# EAGLE board Schematic_tema_tsc (EAGLE 9.7.0)
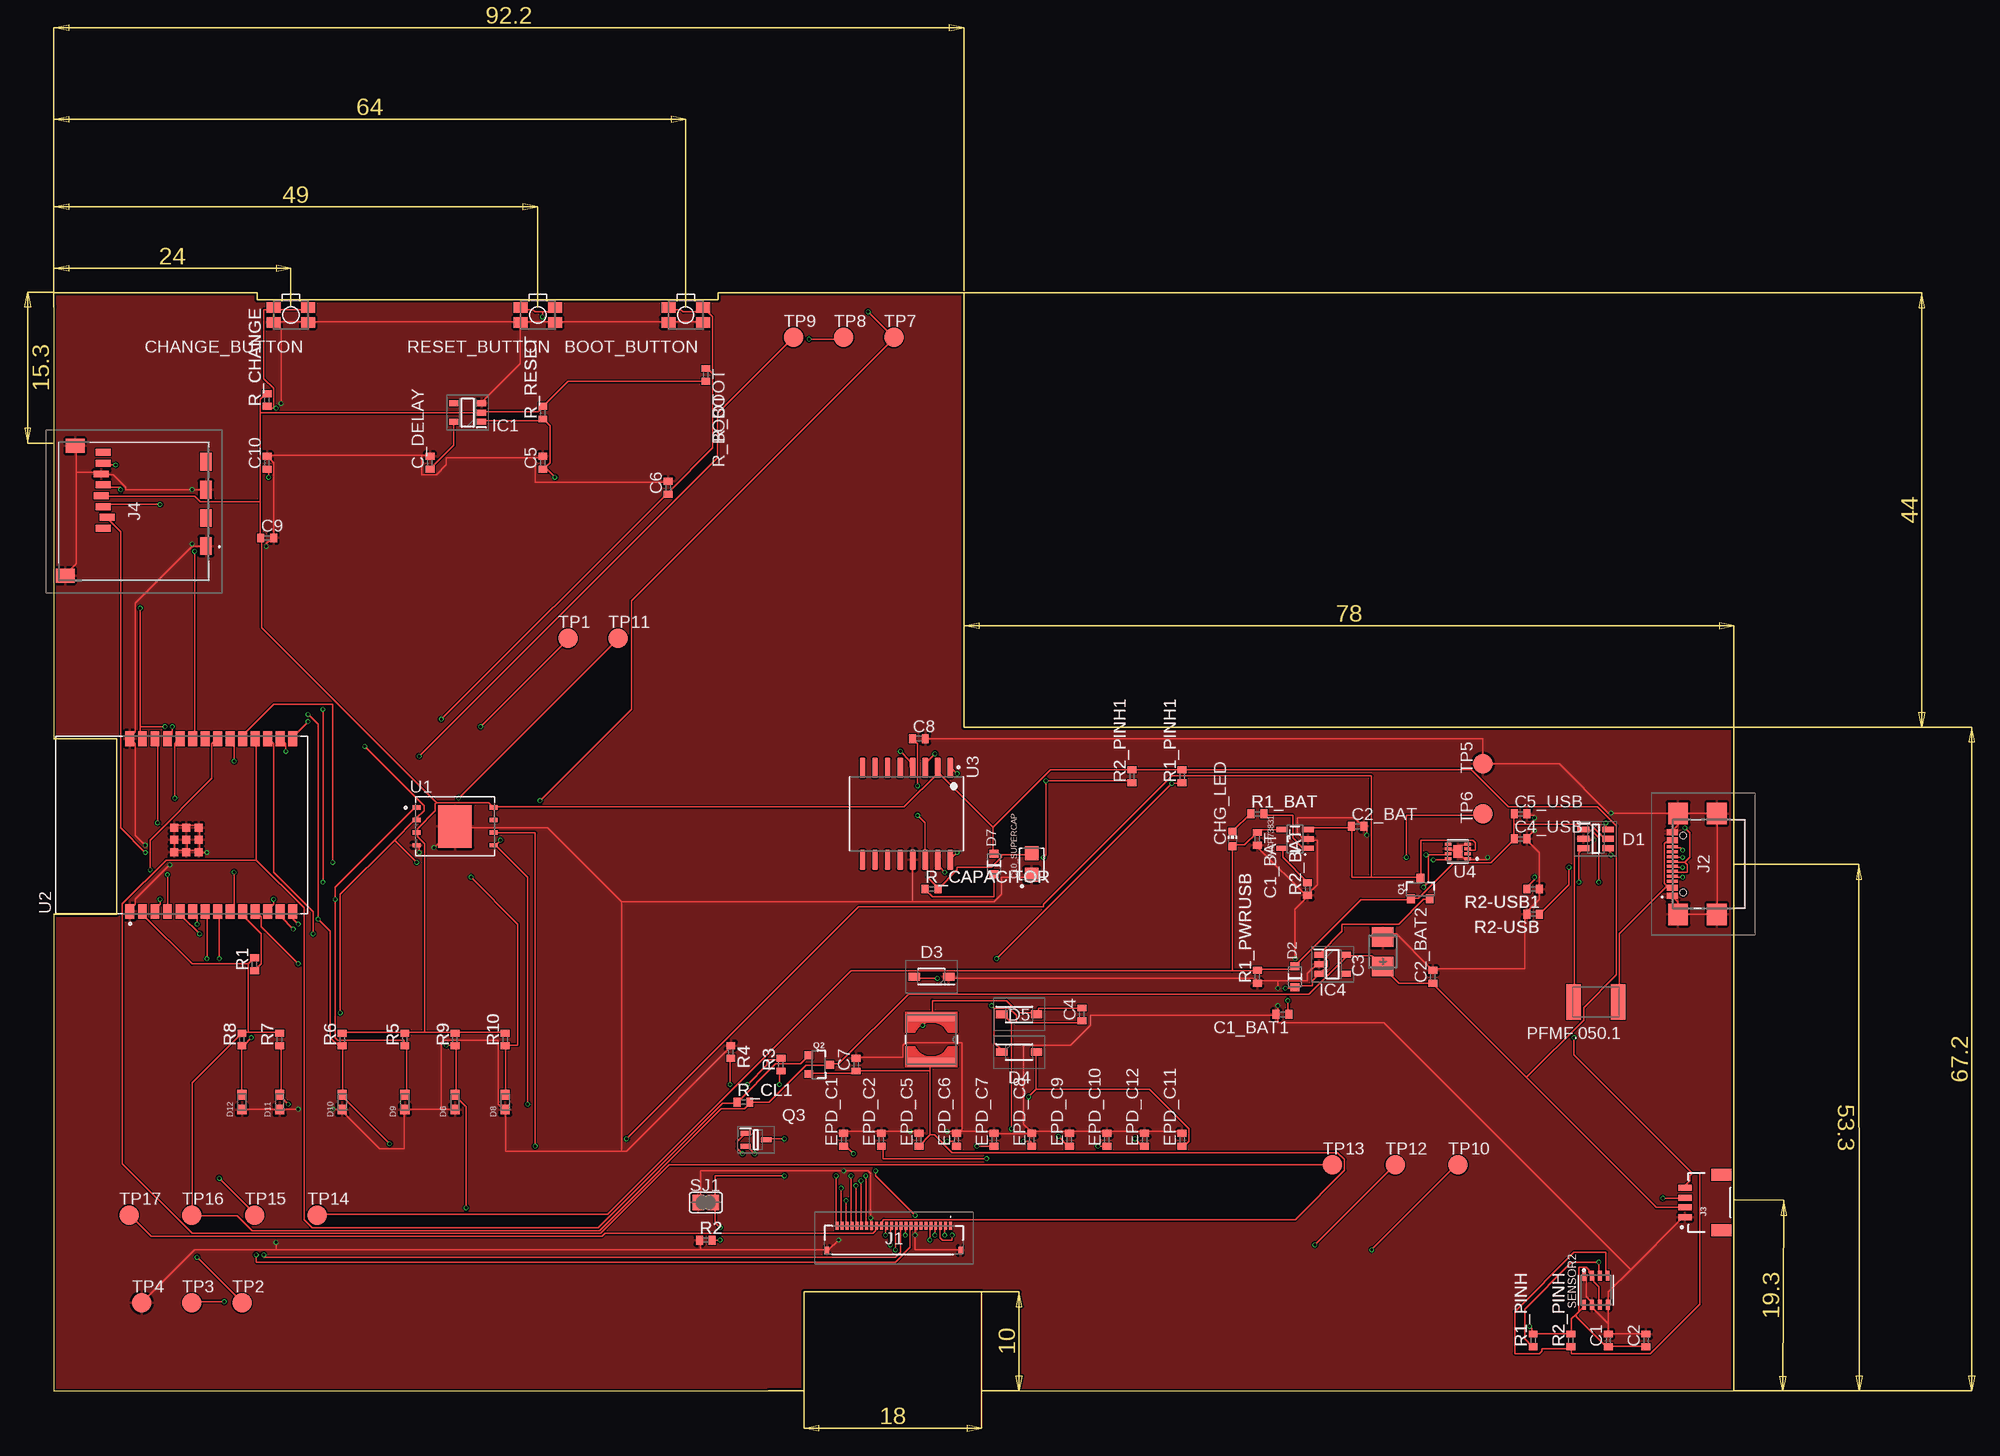
[diagram p1: board, top side]
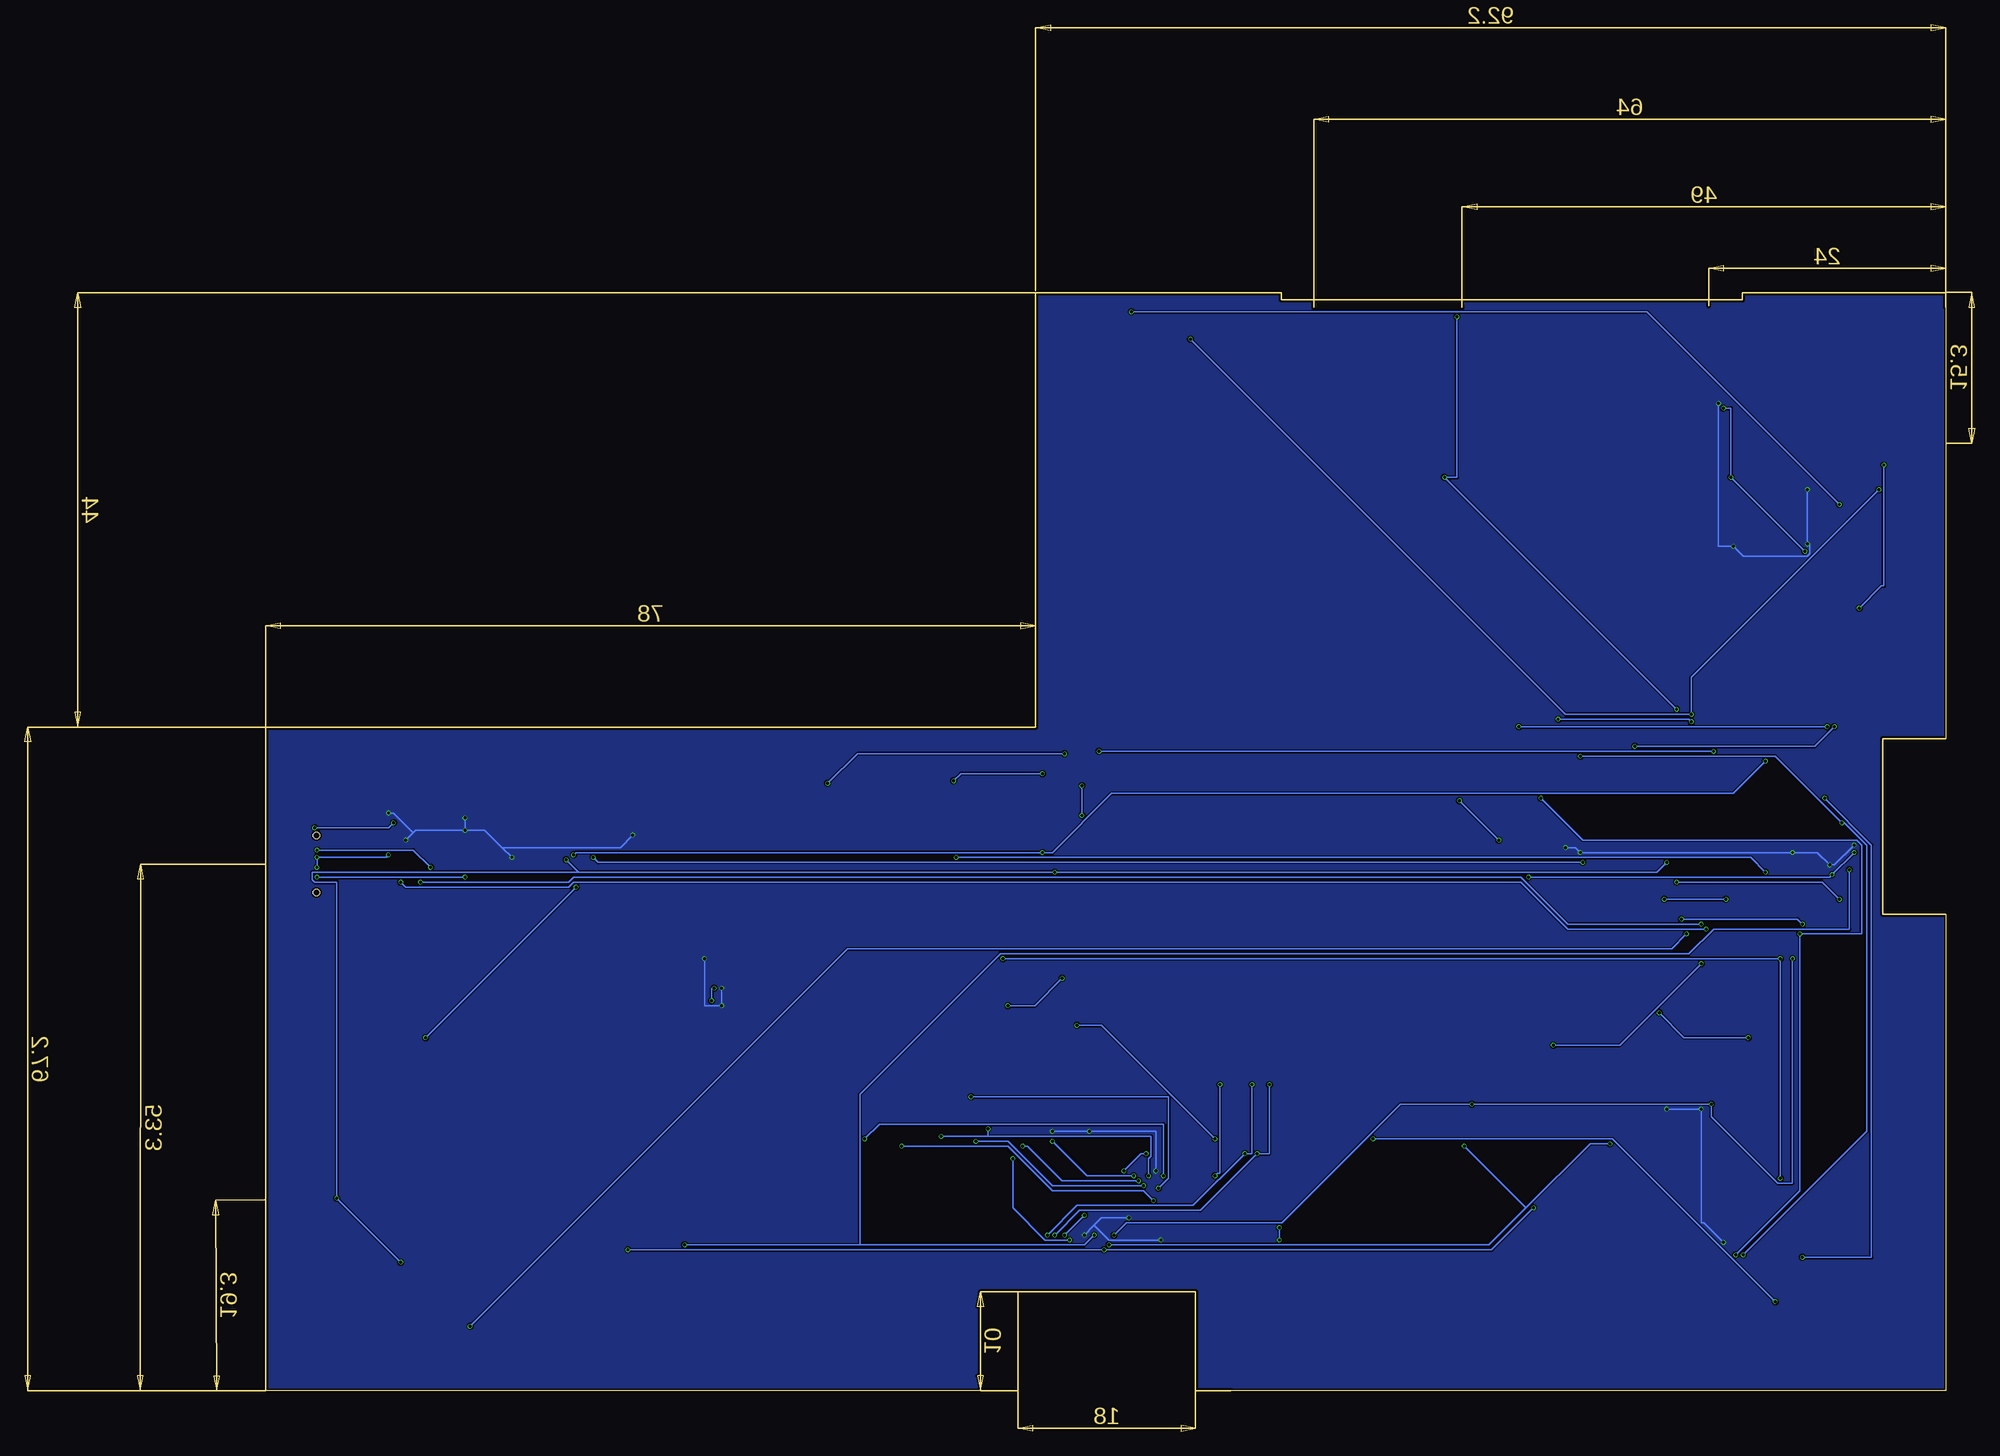
[diagram p2: board, bottom side, seen from below]

Size 170.2 x 111.2 mm. Coordinates in mm from the lower left corner, seen from the top.
Outline: 0,0 72.39,0 75.98,0 75.98,10 93.98,10 93.98,0 170.2,0 170.2,67.2 92.2,67.2 92.2,111.2 67.28,111.2 67.28,110.49 20.61,110.49 20.61,111.2 0,111.2 0,66.04 6.35,66.04 6.35,48.26 0,48.26 0,0
Copper layers (1*16): Top 0.035mm / dielectric 1.6mm / Bottom 0.035mm
Design rules "jlcpcb-2layers.dru": minimum track width 0.15mm, minimum drill 0.3mm, track to track 5mil, track to pad 5mil, pad to pad 5mil, via to via 5mil, smd to smd 5mil, copper to edge 0.2mm, drill to drill 6mil, minimum pad ring 10mil, minimum via ring 3mil, stop-mask expansion 4mil, vias tented up to drill 0mil, thermal gap 10mil

## Footprints (pad centres in the part's own frame; a part is rotated, then mirrored left to right if it is on the bottom)
MYBUTTON = smd 1.4 x 1.05: 1 1.75,0.75; 2 -1.75,0.75; 3 -1.75,-0.75; 4 1.75,-0.75
EAGLE-LTSPICE_C0402 = smd 0.7 x 0.9: 1 -0.65,0; 2 0.65,0
RCL_CT3528 = smd 2 x 2.2: + -1.5,0; - 1.5,0
CAPCP3225X100N = smd 1.4 x 1.4: 1 -1.1,0; 2 1.1,0
ADAFRUIT_CHIP-LED0603 = smd 0.8 x 0.8: A 0,-0.75; C 0,0.75
SOT95P280X145-6N = smd 1.2 x 0.6: 1 -1.25,0.95; 2 -1.25,0; 3 -1.25,-0.95; 4 1.25,-0.95; 5 1.25,0; 6 1.25,0.95
ESP32_WROVER_AVX---SD0805S020S1R0_AVX_SD0805S020S1R0_0 = smd 0.8 x 0.9: 1 -1.05,0; 2 1.05,0
SOD3716X135N = smd 1.15 x 0.8: 1 -1.75,0; 2 1.75,0
DIOC1608X36N = smd 0.97 x 0.94: 1 -0.75,0; 2 0.75,0
SOT95P280X125-5N = smd 0.9 x 0.6: 1 -1.4,0.95; 2 -1.4,0; 3 -1.4,-0.95; 4 1.4,-0.95; 5 1.4,0.95
SOT95P280X120-5N = smd 0.9 x 0.6: 1 -1.4,0.95; 2 -1.4,0; 3 -1.4,-0.95; 4 1.4,-0.95; 5 1.4,0.95
FH34SRJ24S05SH99 = smd 0.3 x 0.8: 1 5.75,1.45; 2 5.25,1.45; 3 4.75,1.45; 4 4.25,1.45; 5 3.75,1.45; 6 3.25,1.45; 7 2.75,1.45; 8 2.25,1.45; 9 1.75,1.45; 10 1.25,1.45; 11 0.75,1.45; 12 0.25,1.45; 13 -0.25,1.45; 14 -0.75,1.45; 15 -1.25,1.45; 16 -1.75,1.45; 17 -2.25,1.45; 18 -2.75,1.45; 19 -3.25,1.45; 20 -3.75,1.45; 21 -4.25,1.45; 22 -4.75,1.45; 23 -5.25,1.45; 24 -5.75,1.45 | smd 0.4 x 0.8: MP1 6.75,-1.05; MP2 -6.75,-1.05
SAMACSYS_PARTS_USB4110GFA = smd 0.3 x 1.15: A1 -3.35,3.678; A4 -2.55,3.678; A5 -1.25,3.678; A6 -0.25,3.678; A7 0.25,3.678; A8 1.25,3.678; A9 2.55,3.678; A12 3.35,3.678; B1 3.05,3.678; B4 2.25,3.678; B5 1.75,3.678; B6 0.75,3.678; B7 -0.75,3.678; B8 -1.75,3.678; B9 -2.25,3.678; B12 -3.05,3.678 | smd 2.18 x 2: MP1 -5.11,-0.827; MP2 5.11,-0.827; MP3 -5.11,3.103; MP4 5.11,3.103 | hole 0.65: -2.89,2.603; 2.89,2.603
JST04_1MM_RA = smd 0.6 x 1.35: 1 -1.5,0; 2 -0.5,0; 3 0.5,0; 4 1.5,0 | smd 1.2 x 2: NC1 2.8,-3.675; NC2 -2.8,-3.675
112ATAARR03ATTEND = smd 1.8 x 1.2: G1 10.6,10.4; G2 4.9,10.4; S1 7.75,10.4; S2 2.05,10.4 | smd 1.4 x 1.9: G3 13.6,-3.85; G4 0.45,-2.85 | smd 0.7 x 1.5: P1 8.8,0; P2 7.7,0.4; P3 6.6,0; P4 5.5,-0.2; P5 4.4,0; P6 3.3,-0.2; P7 2.2,0; P8 1.1,0
IND_4828-WE-TPC_WRE = smd 0.889 x 4.826: 1 -2.286,0; 2 2.286,0
ESP32_WROVER_SPARKFUN-IC-POWER_SOT23-5 = smd 0.55 x 1.2: 1 -0.95,-1.3; 2 0,-1.3; 3 0.95,-1.3; 4 0.95,1.3; 5 -0.95,1.3
ESP32C6_VARISTOR_CT/CN1812 = smd 1.5 x 3.6: 1 -2.25,0; 2 2.25,0
ESP32_WROVER_SPARKFUN-DISCRETESEMI_SOT23-3 = smd 0.8 x 0.9: 1 -0.95,-1; 2 0.95,-1; 3 0,1.1
SOT65P210X110-3N = smd 1.05 x 0.5: 1 -1.05,0.65; 2 -1.05,-0.65; 3 1.05,0
ESP32_WROVER_EAGLE-LTSPICE_R0402 = smd 0.7 x 0.9: 1 -0.65,0; 2 0.65,0
ESP32_WROVER_BME680_PSON80P300X300X100-8N = smd 1.016 x 0.5: 1 1.458,1.2; 2 1.458,0.4; 3 1.458,-0.4; 4 1.458,-1.2; 5 -1.458,-1.22; 6 -1.458,-0.4; 7 -1.458,0.4; 8 -1.458,1.2
SJ = smd 1.168 x 1.6: 1 -0.762,0; 2 0.762,0
TP20R = smd 2 x 2: TP 0,0
SON127P600X800X80-9N = smd 0.94 x 0.44: 1 -3.895,1.905; 2 -3.895,0.635; 3 -3.895,-0.635; 4 -3.895,-1.905; 5 3.895,-1.905; 6 3.895,-0.635; 7 3.895,0.635; 8 3.895,1.905 | smd 3.4 x 4.3: 9 0,0
XCVR_ESP32-C6-WROOM-1-N8 = smd 1.5 x 0.9: 1 -8.75,5.26; 2 -8.75,3.99; 3 -8.75,2.72; 4 -8.75,1.45; 5 -8.75,0.18; 6 -8.75,-1.09; 7 -8.75,-2.36; 8 -8.75,-3.63; 9 -8.75,-4.9; 10 -8.75,-6.17; 11 -8.75,-7.44; 12 -8.75,-8.71; 13 -8.75,-9.98; 14 -8.75,-11.25; 15 8.75,-11.25; 16 8.75,-9.98; 17 8.75,-8.71; 18 8.75,-7.44; 19 8.75,-6.17; 20 8.75,-4.9; 21 8.75,-3.63; 22 8.75,-2.36; 23 8.75,-1.09; 24 8.75,0.18; 25 8.75,1.45; 26 8.75,2.72; 27 8.75,3.99; 28 8.75,5.26 | smd 0.8 x 0.8: 29_1 -2.755,0.79; 29_2 -1.505,0.79; 29_3 -0.255,0.79; 29_4 -2.755,-0.46; 29_5 -1.505,-0.46; 29_6 -0.255,-0.46; 29_7 -2.755,-1.71; 29_8 -1.505,-1.71; 29_9 -0.255,-1.71
SOIC127P1032X265-16N = smd 2.05 x 0.59: 1 -4.655,4.445; 2 -4.655,3.175; 3 -4.655,1.905; 4 -4.655,0.635; 5 -4.655,-0.635; 6 -4.655,-1.905; 7 -4.655,-3.175; 8 -4.655,-4.445; 9 4.655,-4.445; 10 4.655,-3.175; 11 4.655,-1.905; 12 4.655,-0.635; 13 4.655,0.635; 14 4.655,1.905; 15 4.655,3.175; 16 4.655,4.445
SON50P200X200X80-9N = smd 0.76 x 0.27: 1 -0.985,0.75; 2 -0.985,0.25; 3 -0.985,-0.25; 4 -0.985,-0.75; 5 0.985,-0.75; 6 0.985,-0.25; 7 0.985,0.25; 8 0.985,0.75 | smd 0.9 x 1.3: 9 0,0

## Placement (x,y rotation side)
BOOT_BUTTON  BUTTON_CUSYOMV1  [MYBUTTON]  64.01,108.94 180 top
C1  100nF  [EAGLE-LTSPICE_C0402]  157.48,5.08 90 top
C1_BAT  4.7uF  [EAGLE-LTSPICE_C0402]  121.92,55.88 270 top
C1_BAT1  4.7uF  [EAGLE-LTSPICE_C0402]  124.46,38.1 180 top
C2  100nF  [EAGLE-LTSPICE_C0402]  161.29,5.08 90 top
C2_BAT  4.7uF  [EAGLE-LTSPICE_C0402]  132.08,57.15 0 top
C2_BAT2  4.7uF  [EAGLE-LTSPICE_C0402]  139.7,41.91 90 top
C3  100uF  [RCL_CT3528]  134.62,44.45 90 top
C4  4.7uF/25V  [EAGLE-LTSPICE_C0402]  104.14,38.1 90 top
C4_USB  100nF  [EAGLE-LTSPICE_C0402]  148.59,55.88 0 top
C5  1uF  [EAGLE-LTSPICE_C0402]  49.53,93.98 90 top
C5_USB  4.7uF  [EAGLE-LTSPICE_C0402]  148.59,58.42 0 top
C6  100nF  [EAGLE-LTSPICE_C0402]  62.23,91.44 90 top
C7  10uF  [EAGLE-LTSPICE_C0402]  81.28,33.02 90 top
C8  100nF  [EAGLE-LTSPICE_C0402]  87.63,66.04 0 top
C9  100nF  [EAGLE-LTSPICE_C0402]  21.59,86.36 0 top
C10  100nF  [EAGLE-LTSPICE_C0402]  21.59,93.98 90 top
C10_SUPERCAP  CPH3225A  [CAPCP3225X100N]  99.06,53.34 90 top
C_DELAY  100nF  [EAGLE-LTSPICE_C0402]  38.1,93.98 90 top
CHANGE_BUTTON  BUTTON_CUSYOMV1  [MYBUTTON]  24,108.94 180 top
CHG_LED  [ADAFRUIT_CHIP-LED0603]  119.38,55.88 0 top
D1  USBLC6-2SC6Y  [SOT95P280X145-6N]  156.21,55.88 0 top
D2  ESP32_WROVER_AVX---SD0805S020S1R0_AVX_SD0805S020S1R0_0_0AVX_SD0805S020S1R0_0_0  [ESP32_WROVER_AVX---SD0805S020S1R0_AVX_SD0805S020S1R0_0]  125.73,41.91 90 top
D3  MBR0530  [SOD3716X135N]  88.9,41.91 180 top
D4  MBR0530  [SOD3716X135N]  97.79,34.29 0 top
D5  MBR0530  [SOD3716X135N]  97.79,38.1 0 top
D6  PGB1010603MR  [DIOC1608X36N]  40.64,29.21 90 top
D7  ESP32_WROVER_AVX---SD0805S020S1R0_AVX_SD0805S020S1R0_0_0AVX_SD0805S020S1R0_0_0  [ESP32_WROVER_AVX---SD0805S020S1R0_AVX_SD0805S020S1R0_0]  95.25,53.34 90 top
D8  PGB1010603MR  [DIOC1608X36N]  45.72,29.21 90 top
D9  PGB1010603MR  [DIOC1608X36N]  35.56,29.21 90 top
D10  PGB1010603MR  [DIOC1608X36N]  29.21,29.21 90 top
D11  PGB1010603MR  [DIOC1608X36N]  22.86,29.21 90 top
D12  PGB1010603MR  [DIOC1608X36N]  19.05,29.21 90 top
EPD_C1  1uF/50V  [EAGLE-LTSPICE_C0402]  80.01,25.4 90 top
EPD_C2  1uF/50V  [EAGLE-LTSPICE_C0402]  83.82,25.4 90 top
EPD_C5  0.1uF  [EAGLE-LTSPICE_C0402]  87.63,25.4 90 top
EPD_C6  1uF/50V  [EAGLE-LTSPICE_C0402]  91.44,25.4 90 top
EPD_C7  1uF/50V  [EAGLE-LTSPICE_C0402]  95.25,25.4 90 top
EPD_C8  1uF/50V  [EAGLE-LTSPICE_C0402]  99.06,25.4 90 top
EPD_C9  1uF/50V  [EAGLE-LTSPICE_C0402]  102.87,25.4 90 top
EPD_C10  1uF/50V  [EAGLE-LTSPICE_C0402]  106.68,25.4 90 top
EPD_C11  1uF/50V  [EAGLE-LTSPICE_C0402]  114.3,25.4 90 top
EPD_C12  1uF/50V  [EAGLE-LTSPICE_C0402]  110.49,25.4 90 top
IC1  BD5229G-TR  [SOT95P280X125-5N]  41.91,99.06 180 top
IC4  XC6220A331MR-G  [SOT95P280X120-5N]  129.54,43.18 0 top
J1  FH34SRJ-24S-0.5SH_99_  [FH34SRJ24S05SH99]  85.09,15.24 0 top
J2  SAMACSYS_PARTS_USB4110-GF-A  [SAMACSYS_PARTS_USB4110GFA]  167.64,53.34 90 top
J3  QWIIC_RIGHT_ANGLE  [JST04_1MM_RA]  165.25,19.05 90 top
J4  112A-TAAR-R03_ATTEND  [112ATAARR03ATTEND]  5,96.14 270 top
L1  68uF  [IND_4828-WE-TPC_WRE]  88.9,35.56 270 top
MCP73831  ESP32_WROVER_SPARKFUN-IC-POWER_MCP73831  [ESP32_WROVER_SPARKFUN-IC-POWER_SOT23-5]  125.73,55.88 90 top
PFMF.050.1  ESP32C6_VARISTORCN1812  [ESP32C6_VARISTOR_CT/CN1812]  156.21,39.37 180 top
Q1  20V/4.2A/52mΩ/1.4W  [ESP32_WROVER_SPARKFUN-DISCRETESEMI_SOT23-3]  138.43,50.8 0 top
Q2  20V/4.2A/52mΩ/1.4W  [ESP32_WROVER_SPARKFUN-DISCRETESEMI_SOT23-3]  77.47,33.02 270 top
Q3  SI1308EDL-T1-GE3  [SOT65P210X110-3N]  71.12,25.4 0 top
R1  10K  [ESP32_WROVER_EAGLE-LTSPICE_R0402]  20.32,43.18 90 top
R1_BAT  200  [ESP32_WROVER_EAGLE-LTSPICE_R0402]  121.92,58.42 0 top
R1_PINH  10K  [ESP32_WROVER_EAGLE-LTSPICE_R0402]  149.86,5.08 90 top
R1_PINH1  10K  [ESP32_WROVER_EAGLE-LTSPICE_R0402]  114.3,62.23 90 top
R1_PWRUSB  100K  [ESP32_WROVER_EAGLE-LTSPICE_R0402]  121.92,41.91 90 top
R2  2.2  [ESP32_WROVER_EAGLE-LTSPICE_R0402]  66.04,15.24 0 top
R2-USB  5k1  [ESP32_WROVER_EAGLE-LTSPICE_R0402]  149.86,48.26 180 top
R2-USB1  5k1  [ESP32_WROVER_EAGLE-LTSPICE_R0402]  149.86,50.8 180 top
R2_BAT  2K  [ESP32_WROVER_EAGLE-LTSPICE_R0402]  127,50.8 90 top
R2_PINH  10K  [ESP32_WROVER_EAGLE-LTSPICE_R0402]  153.67,5.08 90 top
R2_PINH1  10K  [ESP32_WROVER_EAGLE-LTSPICE_R0402]  109.22,62.23 90 top
R3  0.47  [ESP32_WROVER_EAGLE-LTSPICE_R0402]  73.66,33.02 90 top
R4  10K  [ESP32_WROVER_EAGLE-LTSPICE_R0402]  68.58,34.29 270 top
R5  10K  [ESP32_WROVER_EAGLE-LTSPICE_R0402]  35.56,35.56 90 top
R6  10K  [ESP32_WROVER_EAGLE-LTSPICE_R0402]  29.21,35.56 90 top
R7  10K  [ESP32_WROVER_EAGLE-LTSPICE_R0402]  22.86,35.56 90 top
R8  10K  [ESP32_WROVER_EAGLE-LTSPICE_R0402]  19.05,35.56 90 top
R9  10K  [ESP32_WROVER_EAGLE-LTSPICE_R0402]  40.64,35.56 90 top
R10  10K  [ESP32_WROVER_EAGLE-LTSPICE_R0402]  45.72,35.56 90 top
R_BOOT  10K  [ESP32_WROVER_EAGLE-LTSPICE_R0402]  66.04,102.87 270 top
R_CAPACITOR  15  [ESP32_WROVER_EAGLE-LTSPICE_R0402]  88.9,50.8 0 top
R_CHANGE  10K  [ESP32_WROVER_EAGLE-LTSPICE_R0402]  21.59,100.33 90 top
R_CL1  10K  [ESP32_WROVER_EAGLE-LTSPICE_R0402]  69.85,29.21 0 top
R_RESET  10K  [ESP32_WROVER_EAGLE-LTSPICE_R0402]  49.53,99.06 90 top
RESET_BUTTON  BUTTON_CUSYOMV1  [MYBUTTON]  49.02,108.94 180 top
SENSOR2  ESP32_WROVER_BME680_BME680  [ESP32_WROVER_BME680_PSON80P300X300X100-8N]  156.21,10.16 90 top
SJ1  [SJ]  66.04,19.05 0 top
TP1  TPTP20R  [TP20R]  52.07,76.2 0 top
TP2  TPTP20R  [TP20R]  19.05,8.89 0 top
TP3  TPTP20R  [TP20R]  13.97,8.89 0 top
TP4  TPTP20R  [TP20R]  8.89,8.89 0 top
TP5  TPTP20R  [TP20R]  144.78,63.5 90 top
TP6  TPTP20R  [TP20R]  144.78,58.42 90 top
TP7  TPTP20R  [TP20R]  85.09,106.68 0 top
TP8  TPTP20R  [TP20R]  80.01,106.68 0 top
TP9  TPTP20R  [TP20R]  74.93,106.68 0 top
TP10  TPTP20R  [TP20R]  142.24,22.86 0 top
TP11  TPTP20R  [TP20R]  57.15,76.2 0 top
TP12  TPTP20R  [TP20R]  135.89,22.86 0 top
TP13  TPTP20R  [TP20R]  129.54,22.86 0 top
TP14  TPTP20R  [TP20R]  26.67,17.78 0 top
TP15  TPTP20R  [TP20R]  20.32,17.78 0 top
TP16  TPTP20R  [TP20R]  13.97,17.78 0 top
TP17  TPTP20R  [TP20R]  7.62,17.78 0 top
U1  W25Q512JVEIQ  [SON127P600X800X80-9N]  40.64,57.15 0 top
U2  ESP32-C6-WROOM-1-N8  [XCVR_ESP32-C6-WROOM-1-N8]  12.95,57.28 90 top
U3  DS3231SN#  [SOIC127P1032X265-16N]  86.36,58.42 270 top
U4  MAX17048G+T10  [SON50P200X200X80-9N]  142.24,54.61 180 top

## Tracks (layer width: path | path; a pad name or v marks a point on that pad's centre or on a via)
3V3
  Top 0.15: R_BOOT.2 65.93,102.21 52.08,102.21 49.58,99.72 R_RESET.2 49.44,99.58 49.03,99.17 43.35,99.17 IC1.2 43.21,99.03 20.91,99.03 | 20.91,99.03 20.91,100.41 21.47,100.97 R_CHANGE.2 | 20.91,99.03 20.91,90.03 | 20.91,90.03 20.91,86.42 C9.1 21.05,86.28 21.05,77.28 38.78,59.55 | 20.91,90.03 14.82,90.03 14.27,90.58 4.85,90.58 J4.P4 | 95.15,57.06 95.15,54.43 D7.2 | 89.61,62.6 95.15,57.06 | 89.61,62.6 89.61,63.02 U3.2 89.61,62.6 | 95.15,57.06 100.97,62.88 109.14,62.88 R2_PINH1.2 109.28,62.88 114.26,62.88 R1_PINH1.2 114.4,62.88 143.62,62.88 147.36,59.14 156.37,59.14 158.31,57.2 158.31,42.1 154.98,38.78 154.98,37.53 149.16,31.72 | 38.78,59.55 38.64,59.42 38.64,58.72 36.84,56.92 36.84,56.65 U1.3 36.84,56.51 36.84,56.09 37.53,55.4 37.53,36.29 | 38.78,59.55 44.04,59.55 44.46,59.14 U1.8 | U1.7 44.6,57.89 44.6,59 U1.8 | R10.2 45.7,36.29 40.72,36.29 R9.2 40.58,36.29 37.53,36.29 | R6.2 29.22,36.29 35.46,36.29 R5.2 35.59,36.29 37.53,36.29 | 89.61,62.6 86.15,59.14 44.6,59.14 U1.8 | 19.67,36.29 22.85,36.29 R7.2 | 19.67,36.29 19.11,36.29 R8.2 18.97,36.15 13.99,31.16 13.99,17.87 TP16.TP 13.99,17.73 18.56,17.73 20.08,16.2 55.26,16.2 67.59,28.53 69.94,28.53 70.5,29.09 R_CL1.2 70.64,29.22 72.44,29.22 76.17,32.96 78.53,32.96 Q2.3 78.67,33.1 79.5,33.1 86.56,40.16 127.14,40.16 131.02,44.04 | 19.67,43.21 20.22,43.77 R1.2 | 19.67,36.29 19.67,43.21 | 19.67,43.21 13.99,43.21 9,48.2 9,48.48 U2.2 | 131.02,44.04 133.51,44.04 134.48,43.07 C3.+ 134.62,42.94 136.28,41.27 139.61,41.27 C2_BAT2.1 139.75,41.13 149.16,31.72 | 149.16,31.72 162.32,18.56 165.23,18.56 J3.2 | 131.02,44.04 IC4.5
32KHZ  (via drill 0.3)
  Top 0.15: v91.5,62.5 91,63 U3.1 | R2_PINH1.1 109,61.75 v100.5,61.75 100.5,54.25 v100.25,54 | v18.25,52.5 18.25,49 18,48.75 U2.9
  Bottom 0.15: v100.5,61.75 99.75,62.5 v91.5,62.5 | v18.25,52.5 19.75,54 v100.25,54
DN  (via drill 0.3)
  Top 0.15: 165.25,53.5 165.5,53.25 165.5,52.5 164,52.5 J2.B7 | 165.25,53.5 164,53.5 J2.A7 | v157.25,57.5 157.25,57 D1.6 | v165.25,57 165.75,56.5 165.75,54 165.25,53.5
  Bottom 0.15: v157.25,57.5 157.75,57 v165.25,57
DP  (via drill 0.3)
  Top 0.15: v165,53 164,53 J2.A6 | v165,54 164,54 J2.B6 | v157.75,54.25 157.75,54.5 157.5,54.75 D1.4
  Bottom 0.15: v165,53 v165,54 158,54 v157.75,54.25
EPD_3V3
  Top 0.15: Q2.2 76.59,32.13 81.02,32.13 81.16,32.27 C7.1 81.3,32.41 88.78,32.41 | 88.78,25.9 87.67,24.79 EPD_C5.1 | 88.78,32.41 88.78,33.24 L1.2 | 88.78,32.41 88.78,25.9 | TP17.TP 7.76,17.73 9.83,15.65 55.54,15.65 55.82,15.93 82.96,15.93 83.24,16.2 83.24,16.62 J1.16 83.38,16.76 83.79,16.76 J1.15 83.93,16.76 83.93,17.17 84.07,17.31 125.76,17.31 130.74,22.3 130.74,23.41 130.05,24.1 91,24.1 89.19,25.9 88.78,25.9
EPD_3V3_C
  Top 0.15: Q2.1 76.45,33.93 75.62,33.1 73.13,33.1 69.25,29.22 R_CL1.1 69.11,29.09 67.73,29.09 55.12,16.48 26.18,16.48 25.35,17.31 25.35,48.89 20.5,53.74 | 20.5,53.74 20.5,65.93 U2.18 | 20.5,53.74 11.36,53.74 6.92,49.31 6.92,22.99 13.99,15.93 55.4,15.93 62.33,22.85 129.5,22.85 TP13.TP
EPD_BUSY  (via drill 0.3)
  Top 0.15: v20.5,13.75 20.5,13 85.25,13 86.75,14.5 86.75,16.5 J1.9 | v10.5,57.5 10.5,65.75 10.25,66 U2.26 | TP9.TP 67.25,99 67.25,94.5 v37,64.25
  Bottom 0.15: v20.5,13.75 8,26.25 8,55.25 10.25,57.5 v10.5,57.5 17.25,64.25 v37,64.25
EPD_CS  (via drill 0.3)
  Top 0.15: v24.75,43.25 21,47 21,48 20.5,48.5 U2.11 | v39.75,35 40.5,35 R9.1 40.75,34.75 40.75,30 D6.2 40.75,29.75 41.75,28.75 v41.75,18.5 | v85.25,14.25 85.25,16.5 J1.12 | v133.5,14.25 142,22.75 TP10.TP
  Bottom 0.15: v24.75,43.25 33,35 v39.75,35 | v133.5,14.25 v85.25,14.25 46,14.25 v41.75,18.5
EPD_DC  (via drill 0.3)
  Top 0.15: v21.25,13.75 21.25,13.5 85.25,13.5 85.75,14 85.75,16.5 J1.11 | v14.75,46.25 13,48 13,48.5 U2.5 | v41,60 57,76 TP11.TP
  Bottom 0.15: v21.25,13.75 14.75,20.25 v14.75,46.25 8.5,46.25 8.5,55.25 9,55.75 36.75,55.75 v41,60
EPD_RST  (via drill 0.3)
  Top 0.15: v86.25,15.75 86.25,16.5 J1.10 | v127.75,14.75 135.75,22.75 TP12.TP | v9.75,52.75 9.75,55.75 16,62 16,65.5 16.5,66 U2.21
  Bottom 0.15: v86.25,15.75 87.25,14.75 110,14.75 | v127.75,14.75 110,14.75 | v9.75,52.75 9.75,46.75 23.5,46.75 26,44.25 95.75,44.25 110,30 110,14.75
FLASH_CS  (via drill 0.3)
  Top 0.15: D9.2 35.75,30 35.75,34.75 R5.1 35.5,35 35.5,35.5 28.75,35.5 28.5,35.75 v28.5,49.75 28.5,51 36.5,59 U1.1 | v22.25,49.75 22.25,49.25 21.75,48.75 U2.12
  Bottom 0.15: v28.5,49.75 v22.25,49.75
GDR  (via drill 0.3)
  Top 0.15: v90.25,15.75 90.25,16.5 J1.2 | v69.75,24 69.25,24.5 69.25,25.25 70,26 Q3.1 | v68.5,31 68.5,33.5 R4.2
  Bottom 0.15: v90.25,15.75 87.75,18.25 75.5,18.25 v69.75,24 68.5,24 v68.5,31
GND  (via drill 0.3)
  Top 0.15: D12.1 19.25,28.5 22.75,28.5 D11.1 23,28.5 v24.75,28.5 | 39.25,28.5 35.75,28.5 D9.1 35.5,28.25 35.5,24.5 33,24.5 29.25,28.25 D10.1 29,28.5 v28.25,28.5 | 39.25,28.5 40.5,28.5 D6.1 | 87,49.5 95.25,49.5 96,50.25 96,52 99,52 C10_SUPERCAP.1 | 87,49.5 87,53.75 U3.13 | 57.5,24.25 45.75,24.25 45.75,28.25 D8.1 45.5,28.5 45,29 45,35.5 39.5,35.5 39.25,35.25 39.25,28.5 | 57.5,24.25 58,24.25 68.5,34.75 R4.1 | 57.5,49.5 87,49.5 | 57.5,24.25 57.5,49.5 | BOOT_BUTTON.2 65.75,108.25 62.5,108.25 BOOT_BUTTON.1 62.25,108.25 51,108.25 RESET_BUTTON.2 50.75,108.25 47.5,108.25 RESET_BUTTON.1 | IC1.3 43.5,100.25 47.25,104 47.25,108 RESET_BUTTON.1 | RESET_BUTTON.1 47.25,108.25 26,108.25 CHANGE_BUTTON.2 25.75,108.25 22.5,108.25 CHANGE_BUTTON.1 22.5,108 23,107.5 v23,100 | 37.25,94.75 21.75,94.75 C10.2 21.75,94.5 22.25,94 22.25,86.5 C9.2 22,86.25 21.5,85.75 v21.5,85.5 | 37.25,94.75 38,94.75 C_DELAY.2 | 48.75,94.5 39.75,94.5 39.75,93.75 38.75,92.75 37.25,92.75 37.25,94.75 | 48.75,94.5 49.5,94.5 C5.2 | 48.75,94.5 48.75,92 62,92 C6.2 | 2.25,93 4.75,93 J4.P6 5,92.75 6,92.75 7.25,91.5 7.25,91.25 v14,91.25 15.25,91.25 J4.G2 | 2.25,93 2.25,95.5 J4.G4 | 2.25,93 2.25,83.75 1.25,82.75 J4.G3 | 14,85.5 8.25,79.75 8.25,66.75 7.75,66.25 U2.28 7.75,66 8.25,65.5 8.25,56.25 v9.25,55.25 | 14,85.5 15.25,85.5 J4.G1 | U2.29_3 12.25,57.25 13.25,57.25 U2.29_6 13.5,57.25 14.5,57.25 U2.29_9 14.75,57 14.75,56 U2.29_8 14.75,55.75 14.75,54.75 U2.29_7 | 12.25,54.75 12.25,55.75 U2.29_2 | 13.5,54.75 13.5,55.75 U2.29_5 | 12.25,54.75 13.25,54.75 U2.29_4 13.5,54.75 | 12.25,54.75 U2.29_1 | 13.5,54.75 14.5,54.75 U2.29_7 | v37,54.5 37,55 U1.4
  Top 0.15: v38.5,55 40.5,57 U1.9 40.75,57 50,57 57.5,49.5 | v11.75,53.25 8.25,49.75 8.25,49.25 7.75,48.75 U2.1 | v15.5,54.5 14.75,54.5 U2.29_7 | 14,85.5 v14,85.75 | 127,50 122,55 C1_BAT.2 | C3.- 134.75,46 134.75,46.25 136,46.25 139.5,42.75 C2_BAT2.2 139.75,42.75 149,42.75 149,48.25 R2-USB.2 149.25,48.5 150.5,49.75 150.5,50.75 R2-USB1.1 150.5,51 150.5,54.5 149.25,55.75 C4_USB.2 149.25,56 v150,56.75 | U4.9 142.25,54.5 143,53.75 U4.1 143.25,53.75 145.25,53.75 v145.25,54 | U4.6 141.5,54.75 142,54.75 U4.9 | U4.4 143,55.25 142.25,55.25 142.25,54.75 U4.9 | v150,58 150,58.25 149.25,58.25 C5_USB.2 | v156,55.75 155,55.75 D1.2 | v133,56.25 133,56.75 132.75,57 C2_BAT.2 132.5,57.25 131.75,58 126,58 126,56.5 126.5,56 127,56 MCP73831.2 127.25,55.75 128,55.75 128,51.25 127,50.25 R2_BAT.1 127,50 | 164,50 164,50.25 J2.B12 | 164,50 164.5,49.5 164.5,48.25 J2.MP3 164.75,48.25 168.25,48.25 J2.MP1 168.5,48.25 168.5,58.25 J2.MP2 168.25,58.5 164.75,58.5 J2.MP4 | 164,50 J2.A1 | 164,56.75 164,56.5 J2.B1 | 164,56.75 164.5,57.25 164.5,58.25 J2.MP4 | 164,56.75 J2.A12 | C8.2 88.5,66 144.75,66 144.75,63.5 TP5.TP 152.5,63.5 157.5,58.5 v157.75,58.5 164.5,58.5 J2.MP4 | J1.MP1 91.75,14.25 87.25,14.25 v87.25,15.75 87.25,16.5 J1.8 | J1.17 82.75,16.75 v82.75,17.5 82.75,22 82.5,22.25 v80,22.25 65.5,22.25 65.5,19.25 SJ1.1 | 65.5,14.25 78.25,14.25 J1.MP2 78.5,14.25 v79.5,15.25 | 65.5,14.25 65.5,15 R2.1 | TP4.TP 14.25,14.25 22.5,14.25 | 65.5,14.25 22.5,14.25 | 124,41.5 127,41.5 127,42.25 128,43.25 IC4.2 | 124,41.5 122,41.5 R1_PWRUSB.1 121.75,41.5 121.75,41.75 90.75,41.75 D3.1 | EPD_C1.2 80.25,26.25 83.75,26.25 EPD_C2.2 84,26.25 v86.75,26.25 87.5,26.25 EPD_C5.2
  Top 0.15: 92,26.25 95.25,26.25 EPD_C7.2 95.25,26 99,26 EPD_C8.2 | 92,26.25 91.5,26.25 EPD_C6.2 91.25,26.25 v90.5,26.25 | 92,26.25 92,35.25 86.25,35.25 86,35 86,33.75 81.5,33.75 C7.2 | 157.5,6.75 157.5,8.5 SENSOR2.5 157.5,8.75 157.5,10 159.75,12.25 | 157.5,6.75 157.5,5.75 | 157.5,5.75 161.25,5.75 C2.2 | 157.5,5.75 C1.2 | 157.5,6.75 156,8.25 156,8.5 SENSOR2.7 155.75,8.75 155.75,9 155.25,9.5 155.25,11.5 SENSOR2.1 | 159.75,12.25 165,17.5 J3.1 | EPD_C11.2 114.25,26.25 110.5,26.25 EPD_C12.2 110.25,26.25 106.75,26.25 EPD_C10.2 106.5,26.25 103,26.25 EPD_C9.2 102.75,26.25 99.25,26.25 EPD_C8.2 | C1_BAT1.2 123.75,38 105,38 105,37 103,35 98.25,35 98.25,27 99,26.25 EPD_C8.2 | 159.75,12.25 134.75,37.25 124,37.25 124,38 C1_BAT1.2 | v124,40.75 124,41.5 | v124,39 124,38.25 C1_BAT1.2 | 127,50 125.75,48.75 v125.75,43.75 | 22.5,14.25 v22.5,15
  Bottom 0.15: v28.25,28.5 v24.75,28.5 24.75,17 24.5,17 v22.5,15 | v38.5,55 37.5,55 v37,54.5 v15.5,54.5 13,54.5 v11.75,53.25 11.25,53.25 v9.25,55.25 | v14,91.25 v14,85.75 13.75,85.75 13.75,84.75 14,84.5 20.5,84.5 v21.5,85.5 23,85.5 v23,100 | v150,56.75 v150,58 | 155.25,56.5 155,56.75 v150,56.75 | 155.25,56.5 v156,55.75 | 146.25,55 148,56.75 v150,56.75 | 146.25,55 v145.25,54 | v133,56.25 134.25,55 146.25,55 | 155.25,56.5 157.25,58.5 v157.75,58.5 | 86.25,16.75 85.5,17.5 v82.75,17.5 | 86.25,16.75 v87.25,15.75 | 86.25,16.75 84.75,15.25 v79.5,15.25 | v90.5,26.25 v86.75,26.25 80,26.25 v80,22.25 | v124,40.75 v124,39 125.75,39 v125.75,43.75
  pour Top: 6.41,48.22 6.39,48.2 6.37,48.18 0.08,48.18 0.08,0.08 75.9,0.08 75.9,10.02 75.92,10.04 75.94,10.06 75.96,10.08 94,10.08 94.02,10.06 94.04,10.04 94.06,10.02 94.06,0.08 170.12,0.08 170.12,67.12 92.18,67.12 92.16,67.14 92.14,67.16 92.12,67.18 92.12,111.12 67.36,111.12 67.36,110.47 67.35,110.45 67.32,110.43 67.3,110.41 20.59,110.41 20.57,110.43 20.54,110.45 20.53,110.47 20.53,111.12 0.08,111.12 0.08,66.12 6.37,66.12 6.39,66.1 6.41,66.08 6.43,66.06 6.43,48.24
  pour Bottom: 6.41,48.22 6.39,48.2 6.37,48.18 0.08,48.18 0.08,0.08 75.9,0.08 75.9,10.02 75.92,10.04 75.94,10.06 75.96,10.08 94,10.08 94.02,10.06 94.04,10.04 94.06,10.02 94.06,0.08 170.12,0.08 170.12,67.12 92.18,67.12 92.16,67.14 92.14,67.16 92.12,67.18 92.12,111.12 67.36,111.12 67.36,110.47 67.35,110.45 67.32,110.43 67.3,110.41 20.59,110.41 20.57,110.43 20.54,110.45 20.53,110.47 20.53,111.12 0.08,111.12 0.08,66.12 6.37,66.12 6.39,66.1 6.41,66.08 6.43,66.06 6.43,48.24
GPIO8
  Top 0.15: R1.1 20.5,42.75 21,43.25 21,46.25 19.25,48 19.25,48.5 U2.10
I2C_PW  (via drill 0.3)
  Top 0.15: SENSOR2.6 156.5,8.75 156.5,10.5 156,11 156,11.5 SENSOR2.2 155.75,11.75 155.5,12 155.5,12.25 155.25,12.5 154.5,12.5 154.5,8 | C2.1 161.25,4.5 157.5,4.5 C1.1 157.25,4.5 154.25,7.5 154.25,7.75 | 154.25,7.75 153.75,7.25 153.75,5.75 R2_PINH.2 153.5,5.75 150,5.75 R1_PINH.2 149.75,5.75 149.75,6.25 v149.5,6.5 | 154.25,7.75 154.5,8 | 154.5,8 155,8.5 SENSOR2.8 | v26.25,46.25 26.25,48.5 22.25,52.5 22.25,65.5 21.75,66 U2.17
  Bottom 0.15: v26.25,46.25 27.75,44.75 111.25,44.75 v149.5,6.5
INT_RTC  (via drill 0.3)
  Top 0.15: v89.25,64.5 88.5,63.75 88.5,63.25 U3.3 | R1_PINH1.1 114.25,61.5 v113.25,61.5 v95.5,43.75 | v16.75,43.75 16.75,48.5 U2.8 | v16.75,21.5 20.25,18 TP15.TP
  Bottom 0.15: v113.25,61.5 110.25,64.5 v89.25,64.5 | v16.75,21.5 v16.75,43.75 v95.5,43.75
IO/BOOT  (via drill 0.3)
  Top 0.15: BOOT_BUTTON.4 62.5,109.5 63.5,109.5 63.75,109.25 65.75,109.25 65.75,109.5 BOOT_BUTTON.3 66,109.5 66.75,108.75 66.75,103 | 66.75,103 66.75,95.5 62.25,91 C6.1 62,90.75 v39.25,68 | 66.75,103 66.25,103.5 R_BOOT.1 | v25.75,67.75 24.25,66.25 U2.15
  Bottom 0.15: v25.75,67.75 26,68 v39.25,68
IO/CHANGE  (via drill 0.3)
  Top 0.15: CHANGE_BUTTON.3 25.75,109.5 22.5,109.5 CHANGE_BUTTON.4 22.25,109.5 21.25,109.5 21.25,102.5 22.25,101.5 22.25,99.5 | v21.75,92.5 21.75,93.25 C10.1 | 22.25,99.5 21.75,99.5 R_CHANGE.1 | 22.25,99.5 v22.5,99.5 | v14.25,85 14.25,66.25 U2.23
  Bottom 0.15: v22.5,99.5 21.75,99.5 v21.75,92.5 v14.25,85
MISO  (via drill 0.3)
  Top 0.15: v6.25,93.75 5,93.75 J4.P7 | 8.75,67.25 8.75,66.25 U2.27 | 8.75,67.25 v8.75,79.25 | D12.2 19,30 19,34.75 R8.1 19.25,35 v20,35.75 | 34.5,55.75 29,50.25 v29,38.25 | 34.5,55.75 36.5,57.75 U1.2 36.75,58 37.5,58.75 37.5,59.25 v31.5,65.25 | v137,54 137,58.25 144.75,58.25 TP6.TP | 34.5,55.75 v36.75,53.5 | v11.25,67.25 8.75,67.25
  Bottom 0.15: v6.25,93.75 6.25,81.5 6.5,81.5 v8.75,79.25 | v29,38.25 26.5,35.75 v20,35.75 | v137,54 136.5,53.5 v36.75,53.5 | v11.25,67.25 13.25,65.25 v31.5,65.25
MOSI  (via drill 0.3)
  Top 0.15: v10.75,89.75 5,89.75 J4.P3 | v82.5,109.25 85,106.75 TP7.TP 85,106.5 58.5,80 58.5,69 v49.25,59.75 | v84.25,15.75 84.25,16.5 J1.14 | v23.75,29 23,29.75 D11.2 23,30 23,34.75 R7.1 | 44.75,55.25 48,52 v48,29 | v15.5,43.75 15.5,48.5 U2.7 | 44.75,55.25 v45.25,55.75 | 44.75,55.25 U1.5
  Bottom 0.15: v10.75,89.75 30.25,109.25 v82.5,109.25 | v84.25,15.75 83,17 67.25,17 55.25,29 v48,29 v23.75,29 23.75,27.75 17,21 15.5,21 v15.5,43.75 | v45.25,55.75 v49.25,59.75
N$1  (via drill 0.3)
  Top 0.15: v79.25,21.75 79.25,16.75 J1.24 | v109.5,25.5 110.25,24.75 EPD_C12.1
  Bottom 0.15: v79.25,21.75 79.25,27 108,27 v109.5,25.5
N$2  (via drill 0.3)
  Top 0.15: v80.25,19.25 80.25,16.75 J1.22 | EPD_C10.1 v105.75,24.75
  Bottom 0.15: v80.25,19.25 81.25,20.25 90.5,20.25 95,24.75 v105.75,24.75
N$3  (via drill 0.3)
  Top 0.15: v150,52 150,51.75 149.25,51 R2-USB1.2 | v165,52 164,52 J2.A5
  Bottom 0.15: v165,52 v150,52
N$4
  Top 0.15: CHG_LED.C 121.25,58.5 R1_BAT.1
N$5  (via drill 0.3)
  Top 0.15: v125,39.5 125,38.25 C1_BAT1.1 | v124.75,40.75 125.5,40.75 D2.1 125.75,41 127.5,41 127.5,41.5 128,42 IC4.3 128.25,42.25 129,43 129,43.5 128.25,44.25 | 128.25,44.25 130.5,46.5 130.5,47.25 136.25,47.25 138.75,49.75 139.25,49.75 Q1.2 | 128.25,44.25 IC4.1
  Bottom 0.15: v125,39.5 125,40.75 v124.75,40.75
N$6  (via drill 0.3)
  Top 0.15: 95.25,38.75 96.75,38.75 97.5,38 97.5,37.25 104,37.25 C4.1 | 95.25,38.75 95.25,35.25 96,34.5 D4.1 | v89.5,41.75 87.25,41.75 D3.2 | 95.25,38.75 v95,39
  Bottom 0.15: v89.5,41.75 92.25,39 v95,39
N$7
  Top 0.15: R1_BAT.2 122.75,58.25 125.5,58.25 125.5,56 126.5,55 127,55 MCP73831.1
N$8  (via drill 0.3)
  Top 0.15: v81.25,20.75 81.25,16.75 J1.20 | v98.25,25.25 99,25.25 99,24.75 EPD_C8.1
  Bottom 0.15: v81.25,20.75 90.5,20.75 95,25.25 v98.25,25.25
N$9
  Top 0.15: R2_BAT.2 127,51.5 124.5,54 124.5,54.75 MCP73831.5
N$10  (via drill 0.3)
  Top 0.15: v81.75,21.25 81.75,16.75 J1.19 | EPD_C7.1 v93.5,24.75
  Bottom 0.15: v81.75,21.25 89.5,21.25 93,24.75 v93.5,24.75
N$11  (via drill 0.3)
  Top 0.15: R2-USB.1 153.5,51.25 v153.5,53 | v165,54.75 164.75,55 164,55 J2.B5
  Bottom 0.15: v153.5,53 155.25,54.75 v165,54.75
N$12  (via drill 0.3)
  Top 0.15: v82.25,21.75 82.25,16.75 J1.18 | v90.5,25.25 91.25,25.25 91.25,24.75 EPD_C6.1
  Bottom 0.15: v82.25,21.75 87,21.75 v90.5,25.25
N$13  (via drill 0.3)
  Top 0.15: v88.75,15.25 88.75,16.5 J1.5 | v94.5,23.5 84,23.5 84,24.75 EPD_C2.1
  Bottom 0.15: v88.75,15.25 91.25,15.25 94.5,18.5 v94.5,23.5
N$14  (via drill 0.3)
  Top 0.15: v89.25,15.75 89.25,16.5 J1.4 | v87.25,17.75 83.25,21.75 v83.25,22.25 | v81,24 80.25,24.75 EPD_C1.1
  Bottom 0.15: v87.25,17.75 v89.25,15.75 | v83.25,22.25 81.5,24 v81,24
N$16
  Top 0.15: C_DELAY.1 38.25,93.5 40.5,95.75 40.5,98 IC1.5
N$20
  Top 0.15: D7.1 95.25,50 89,50 88.25,50.75 R_CAPACITOR.1
PREVGH  (via drill 0.3)
  Top 0.15: v80.75,21.75 80.75,16.75 J1.21 | v101.75,25.75 102.75,24.75 EPD_C9.1 | v97,26.5 97,37.25 96.25,38 D5.1
  Bottom 0.15: v80.75,21.75 80.75,23.5 80.5,23.75 80.5,25.75 97,25.75 | v101.75,25.75 97,25.75 | 97,25.75 v97,26.5
PREVGL  (via drill 0.3)
  Top 0.15: v79.75,20.5 79.75,16.75 J1.23 | 99.5,30.5 v98.75,29.75 | 99.5,30.5 99.5,34.25 D4.2 | 99.5,30.5 111,30.5 115,26.5 115,25.25 114.5,24.75 EPD_C11.1
  Bottom 0.15: v79.75,20.5 78.75,21.5 78.75,29.75 v98.75,29.75
RESE  (via drill 0.3)
  Top 0.15: v91,15.75 91,15.25 90,15.25 89.75,15.5 89.75,16.5 J1.3 | v71,24 70.25,24.75 Q3.2 | v70.25,31 72.25,33 72.25,33.5 73.5,33.5 R3.2
  Bottom 0.15: v91,15.75 88,18.75 76.25,18.75 v71,24 70.25,24 v70.25,31
RESE'  (via drill 0.3)
  Top 0.15: v67.5,15.25 66.75,15.25 R2.2 | v67.5,16.5 67,17 67,19 SJ1.2 67,19.25 67,21.75 v74,21.75 | v73.5,31 73.5,32.25 R3.1
  Bottom 0.15: v67.5,16.5 v67.5,15.25 | v73.5,31 73.5,22 73.75,22 v74,21.75
RESET  (via drill 0.3)
  Top 0.15: 49.5,109.25 50.75,109.25 50.75,109.5 RESET_BUTTON.3 | 49.5,109.25 48.75,109.25 48.5,109.5 47.5,109.5 RESET_BUTTON.4 | IC1.1 43.5,98.25 49.5,98.25 R_RESET.1 49.75,98.25 50.25,97.75 50.25,94 49.75,93.5 | v10.75,49.75 10.75,49.25 10.25,48.75 U2.3 | v27.25,69 v27.25,51.5 | 49.75,93.5 v50.75,92.5 | 49.75,93.5 C5.1 | v49.5,108.75 49.5,109.25
  Bottom 0.15: v10.75,49.75 12.5,51.5 v27.25,51.5 | v27.25,69 v50.75,92.5 49.5,92.5 v49.5,108.75
RTC_RST  (via drill 0.3)
  Top 0.15: v23.5,64.75 23.5,65.5 23,66 U2.16 | v85.75,64.75 86.75,63.75 86.75,63.25 U3.4
  Bottom 0.15: v85.75,64.75 v23.5,64.75
RX  (via drill 0.3)
  Top 0.15: v12.25,60 12.25,65.5 12.75,66 U2.24 | v14.5,13.5 19,9 TP2.TP
  Bottom 0.15: v12.25,60 7.5,55.25 7.5,13.5 v14.5,13.5
SCK  (via drill 0.3)
  Top 0.15: v84.75,14.75 84.75,16.5 J1.13 | v34,25 29.25,29.75 D10.2 29.25,30 29.25,34.75 R6.1 29,34.75 28,35.75 28,46.5 v26.75,47.75 26.75,67.5 v25.75,68.5 | v48.75,24.75 48.75,56.5 44.75,56.5 U1.6 | v14.5,47.25 14.5,48.25 14.25,48.5 U2.6 | v6.75,91.25 6.75,91.5 5,91.5 J4.P5 | v76.5,106.5 80,106.5 TP8.TP
  Bottom 0.15: v84.75,14.75 46.25,14.75 42.5,18.5 | 42.5,18.5 36,25 v34,25 | 42.5,18.5 v48.75,24.75 | v14.5,47.25 15,47.75 v26.75,47.75 | v6.75,91.25 25.75,72.25 v25.75,68.5 38.5,68.5 v76.5,106.5
SCL  (via drill 0.3)
  Top 0.15: SENSOR2.4 157.25,11.75 157.25,14 154,14 148,8 148,3.75 150.5,3.75 150.75,4 150.75,4.25 153.5,4.25 R2_PINH.1 153.75,4.25 153.75,3.75 161.75,3.75 166.75,8.75 166.75,22 166,22 | 166,22 165.75,21.75 165.75,21.25 165.25,20.75 J3.4 | v139,54.25 139.25,54.25 | 139.25,54.25 141.25,54.25 U4.7 | v91.5,54.5 91,54 U3.16 | v18.25,63.75 18.25,65.75 18,66 U2.20 | 166,22 154,34 v154,35.75 | v138.75,51 139.25,51.5 139.25,54.25
  Bottom 0.15: v139,54.25 138.75,54.5 v91.5,54.5 90.5,54.5 84.5,60.5 21.5,60.5 v18.25,63.75 | v138.75,51 v154,35.75
SDA  (via drill 0.3)
  Top 0.15: R1_PINH.1 149.75,4.5 149,5.25 149,8.25 153.75,13 v156.5,13 156.5,11.75 SENSOR2.3 | v163,19.5 165,19.5 J3.3 | v139.75,53.75 141.25,53.75 U4.8 | v90.25,52.5 89.75,53 89.75,53.75 U3.15 | v28.25,53.5 28.25,69.5 22.25,69.5 19.5,66.75 19.5,66.5 19.25,66.25 U2.19
  Bottom 0.15: v156.5,13 v163,19.5 163,51.5 165.25,51.5 165.5,51.75 165.5,52.5 138.5,52.5 | 138.5,52.5 v139.75,53.75 | 138.5,52.5 v90.25,52.5 29.25,52.5 v28.25,53.5
SRC  (via drill 0.3)
  Top 0.15: C4.2 99.75,38.75 99.75,38.25 D5.2 99.5,38.25 97.75,38.25 96.5,39.5 89,39.5 89,38 L1.1 88.75,37.75 v88,37 | v74,25.5 72.25,25.5 Q3.3
  Bottom 0.15: v74,25.5 85.5,37 v88,37
SS_SD  (via drill 0.3)
  Top 0.15: D8.2 45.75,30 45.75,34.75 R10.1 45.75,35 47,35 47,47.25 v42.25,52 | v11.5,52.25 11.5,48.75 U2.4 | v9.25,54.5 6.75,57 6.75,87 5.5,88.25 J4.P2
  Bottom 0.15: v9.25,54.5 v11.5,52.25 11.75,52 v42.25,52
TX  (via drill 0.3)
  Top 0.15: v12,67.25 12,66.5 11.75,66.25 U2.25 | v43.25,67.25 52,76 TP1.TP
  Bottom 0.15: v43.25,67.25 v12,67.25
USB_D+  (via drill 0.3)
  Top 0.15: v154.5,51.5 154.5,54.5 154.75,54.75 D1.3 | v24.75,47.25 24.25,47.75 24.25,48.5 U2.14
  Bottom 0.15: v154.5,51.5 139.5,51.5 139,52 43,52 38.25,47.25 v24.75,47.25
USB_D-  (via drill 0.3)
  Top 0.15: v156.5,51.5 156.5,56 155.75,56.75 155,56.75 D1.1 | v24.25,46.75 23,48 23,48.5 U2.13
  Bottom 0.15: v156.5,51.5 156,51 139.5,51 139,51.5 43,51.5 38.25,46.75 v24.25,46.75
VBAT  (via drill 0.3)
  Top 0.15: 143.25,54.75 143.25,54.25 U4.2 | MCP73831.3 127.25,57 131.25,57 C2_BAT.1 131.5,57 131.5,52 133.5,52 | 133.5,52 138.25,52 Q1.3 138.5,52 138.5,55.75 143.75,55.75 144,55.5 144,54.75 143.25,54.75 | 143.25,54.75 U4.3 | v17.25,9 14,9 TP3.TP | v58,25.5 81.5,49 100.25,49 100.25,49.25 113.25,62.25 133.5,62.25 133.5,52
  Bottom 0.15: v17.25,9 33.75,25.5 v58,25.5
VBUS
  Top 0.15: 147.92,57.34 147.92,55.95 C4_USB.1 147.92,55.82 145.56,53.46 141.82,53.46 138.22,49.86 137.53,49.86 Q1.1 137.39,49.72 132.41,49.72 125.76,43.07 D2.2 125.62,42.94 125.34,42.66 122.02,42.66 R1_PWRUSB.2 121.88,42.52 119.39,42.52 | 147.92,57.34 147.92,58.31 C5_USB.1 | 147.92,57.34 154.01,57.34 | 154.01,57.34 155.67,57.34 157.06,55.95 157.34,55.95 D1.5 | 154.01,57.34 154.01,39.47 PFMF.050.1.2 | MCP73831.4 124.37,56.78 122.16,56.78 122.02,56.65 C1_BAT.1 121.88,56.51 120.63,55.26 119.39,55.26 CHG_LED.A 119.39,42.52 | 119.39,42.52 80.75,42.52 56.09,17.87 26.73,17.87 TP14.TP
VRTC  (via drill 0.3)
  Top 0.15: v87.5,61.25 87.5,65.5 87,66 C8.1 | v87.5,58.25 88.25,57.5 88.25,54 U3.14 88.5,53.75 88.5,52 89.5,51 R_CAPACITOR.2 91.5,52.75 91.5,53 95,53 96,54 96,54.25 99,54.25 C10_SUPERCAP.2
  Bottom 0.15: v87.5,58.25 v87.5,61.25
VUSB
  Top 0.15: J2.A4 163.98,50.83 163.98,50.97 J2.B9 | J2.A9 163.98,55.82 163.98,55.68 J2.B4 163.84,55.54 163.29,55.54 163.15,55.4 163.15,51.38 163.43,51.11 | 163.43,51.11 163.84,51.11 J2.B9 | 163.43,51.11 158.58,46.26 158.58,39.47 PFMF.050.1.1 | 163.43,51.11 J2.B9